# EasyEDA Pro project Sprig-C3 V1.0.1.epro, schematic ESP32-C6 LORA

## Sheets
1 P1: Board Name: Board1; Create Date: 2025-07-06; Page Name: P1; Project Name: ESP32-C3 module_2024-02-14_10-07-03; Schematic Name: ESP32-C6 LORA; Update Date: 2025-07-08; Company: EasyEDA.com; Page Size: A4; Version: V1.0
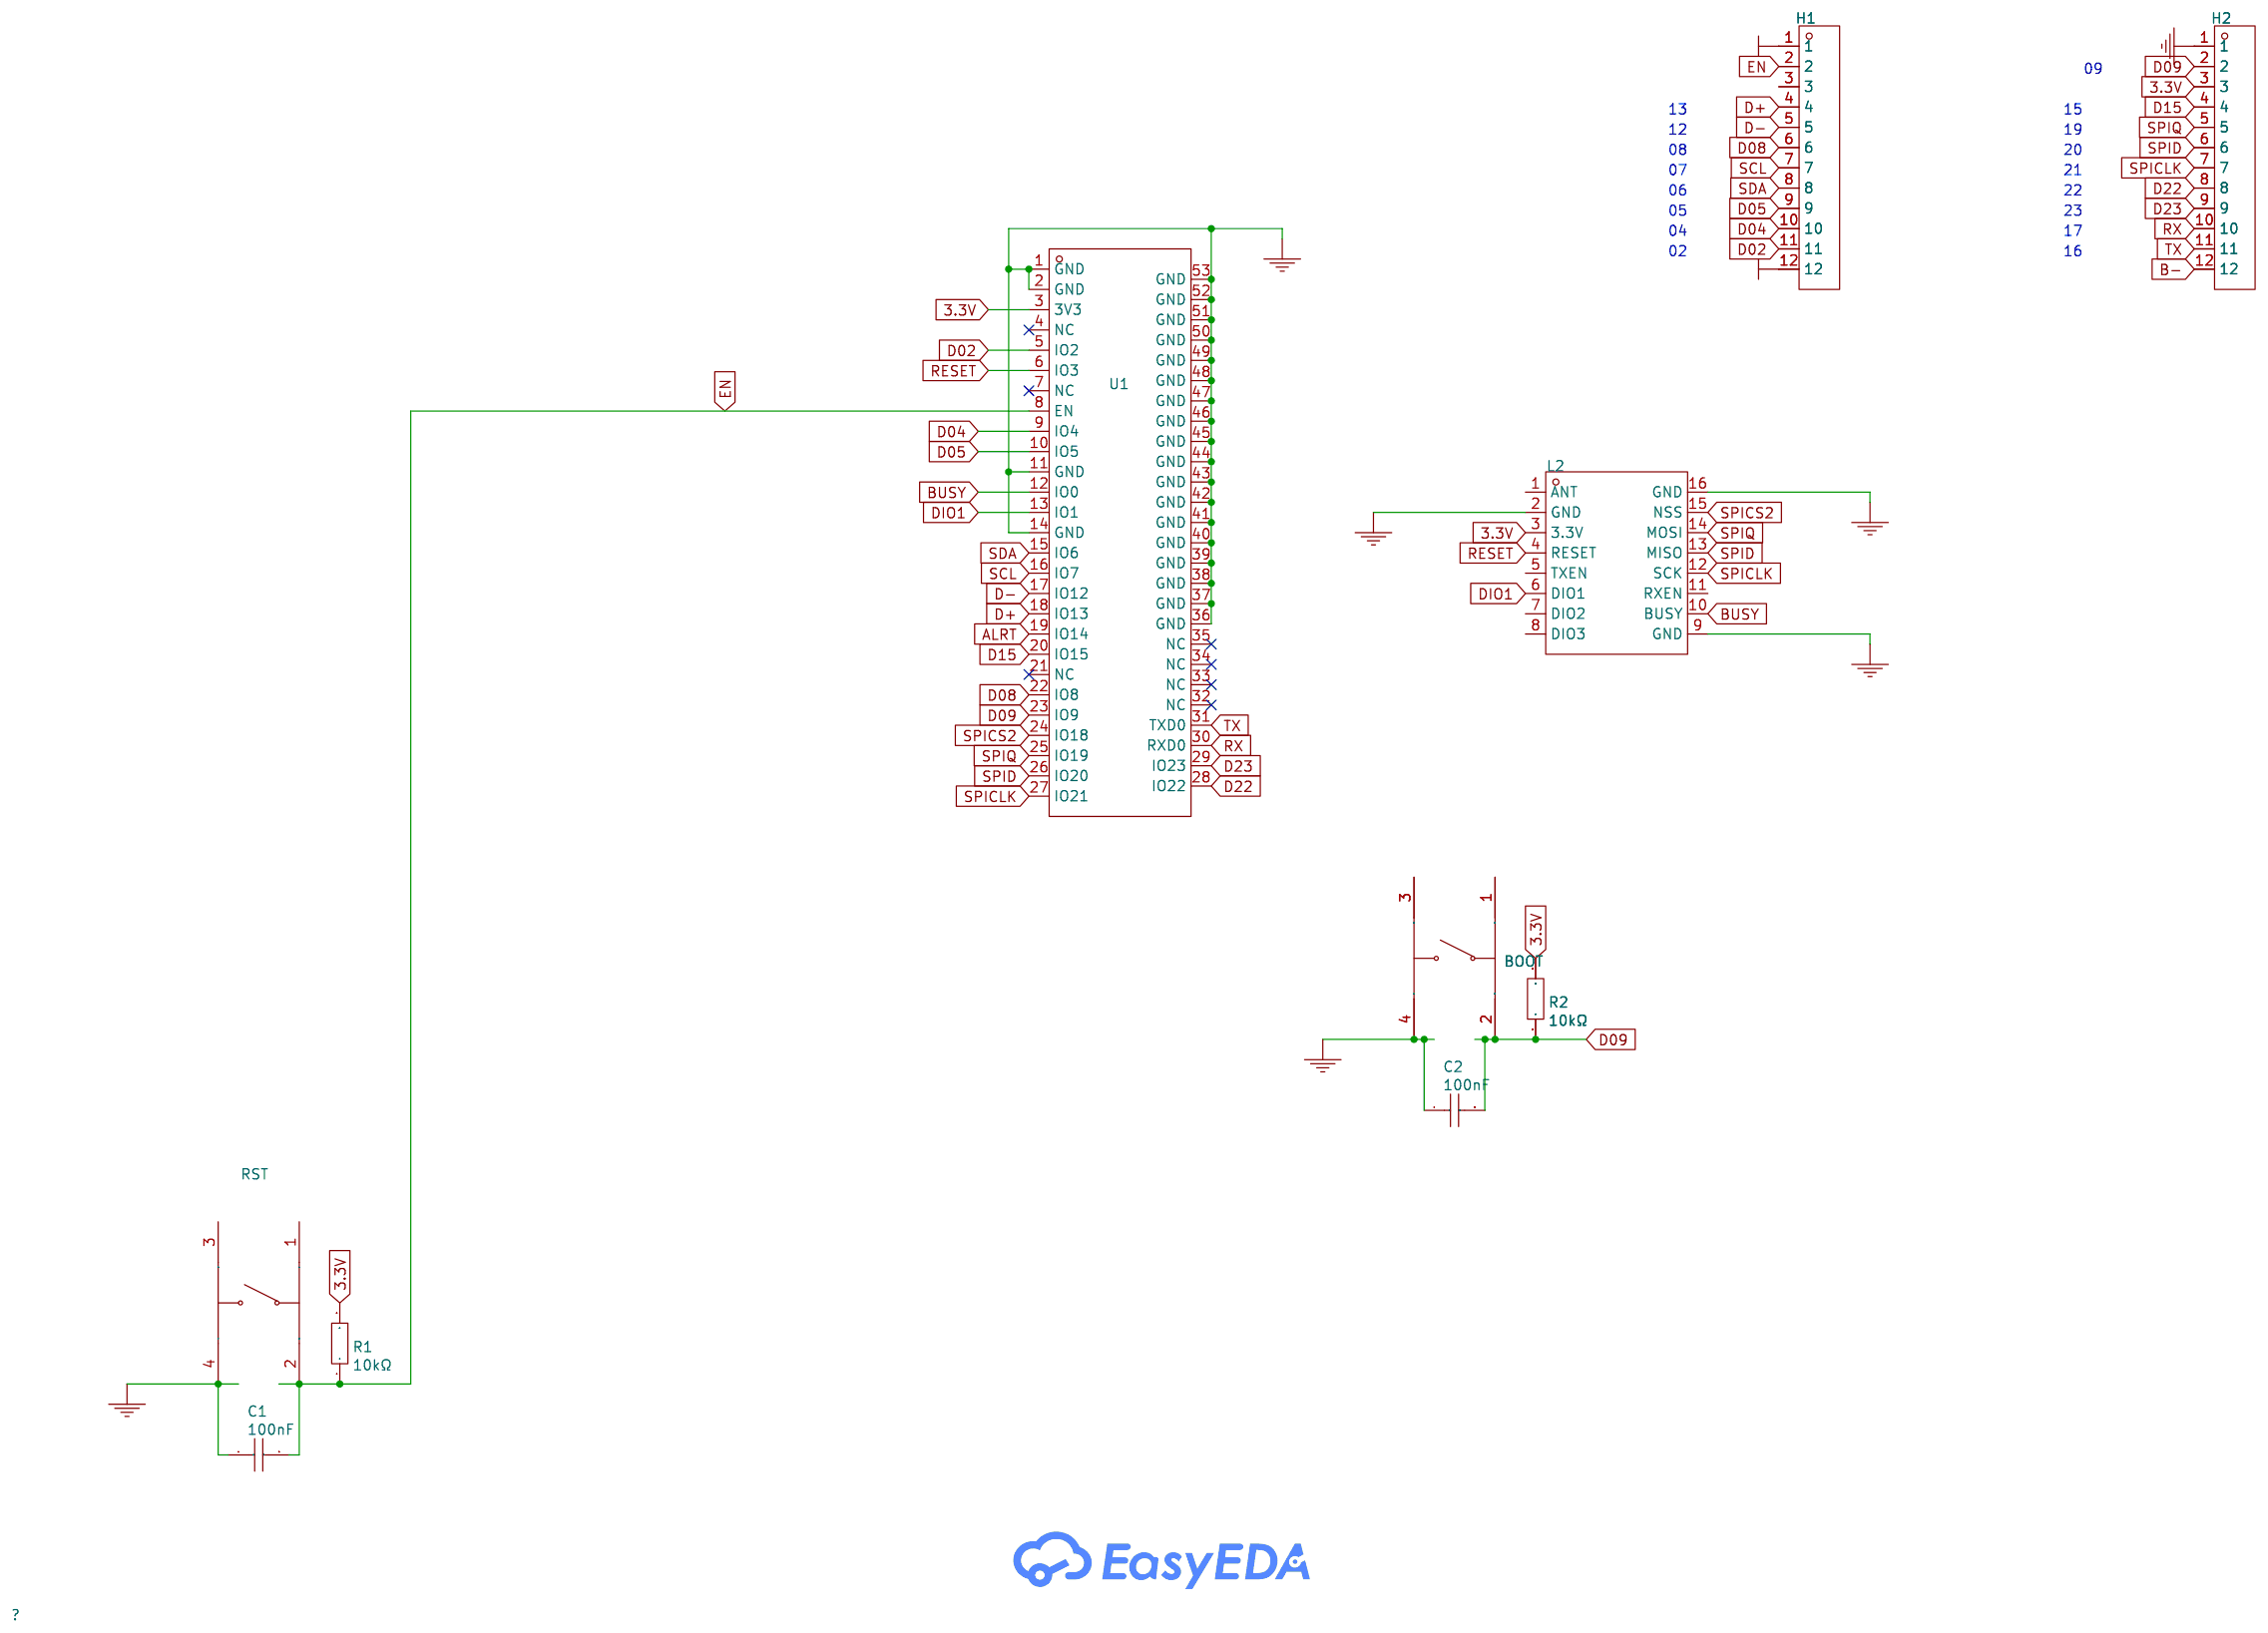
[diagram p0: P1]
2 P2: Page Name: P2; Update Date: 2025-08-02
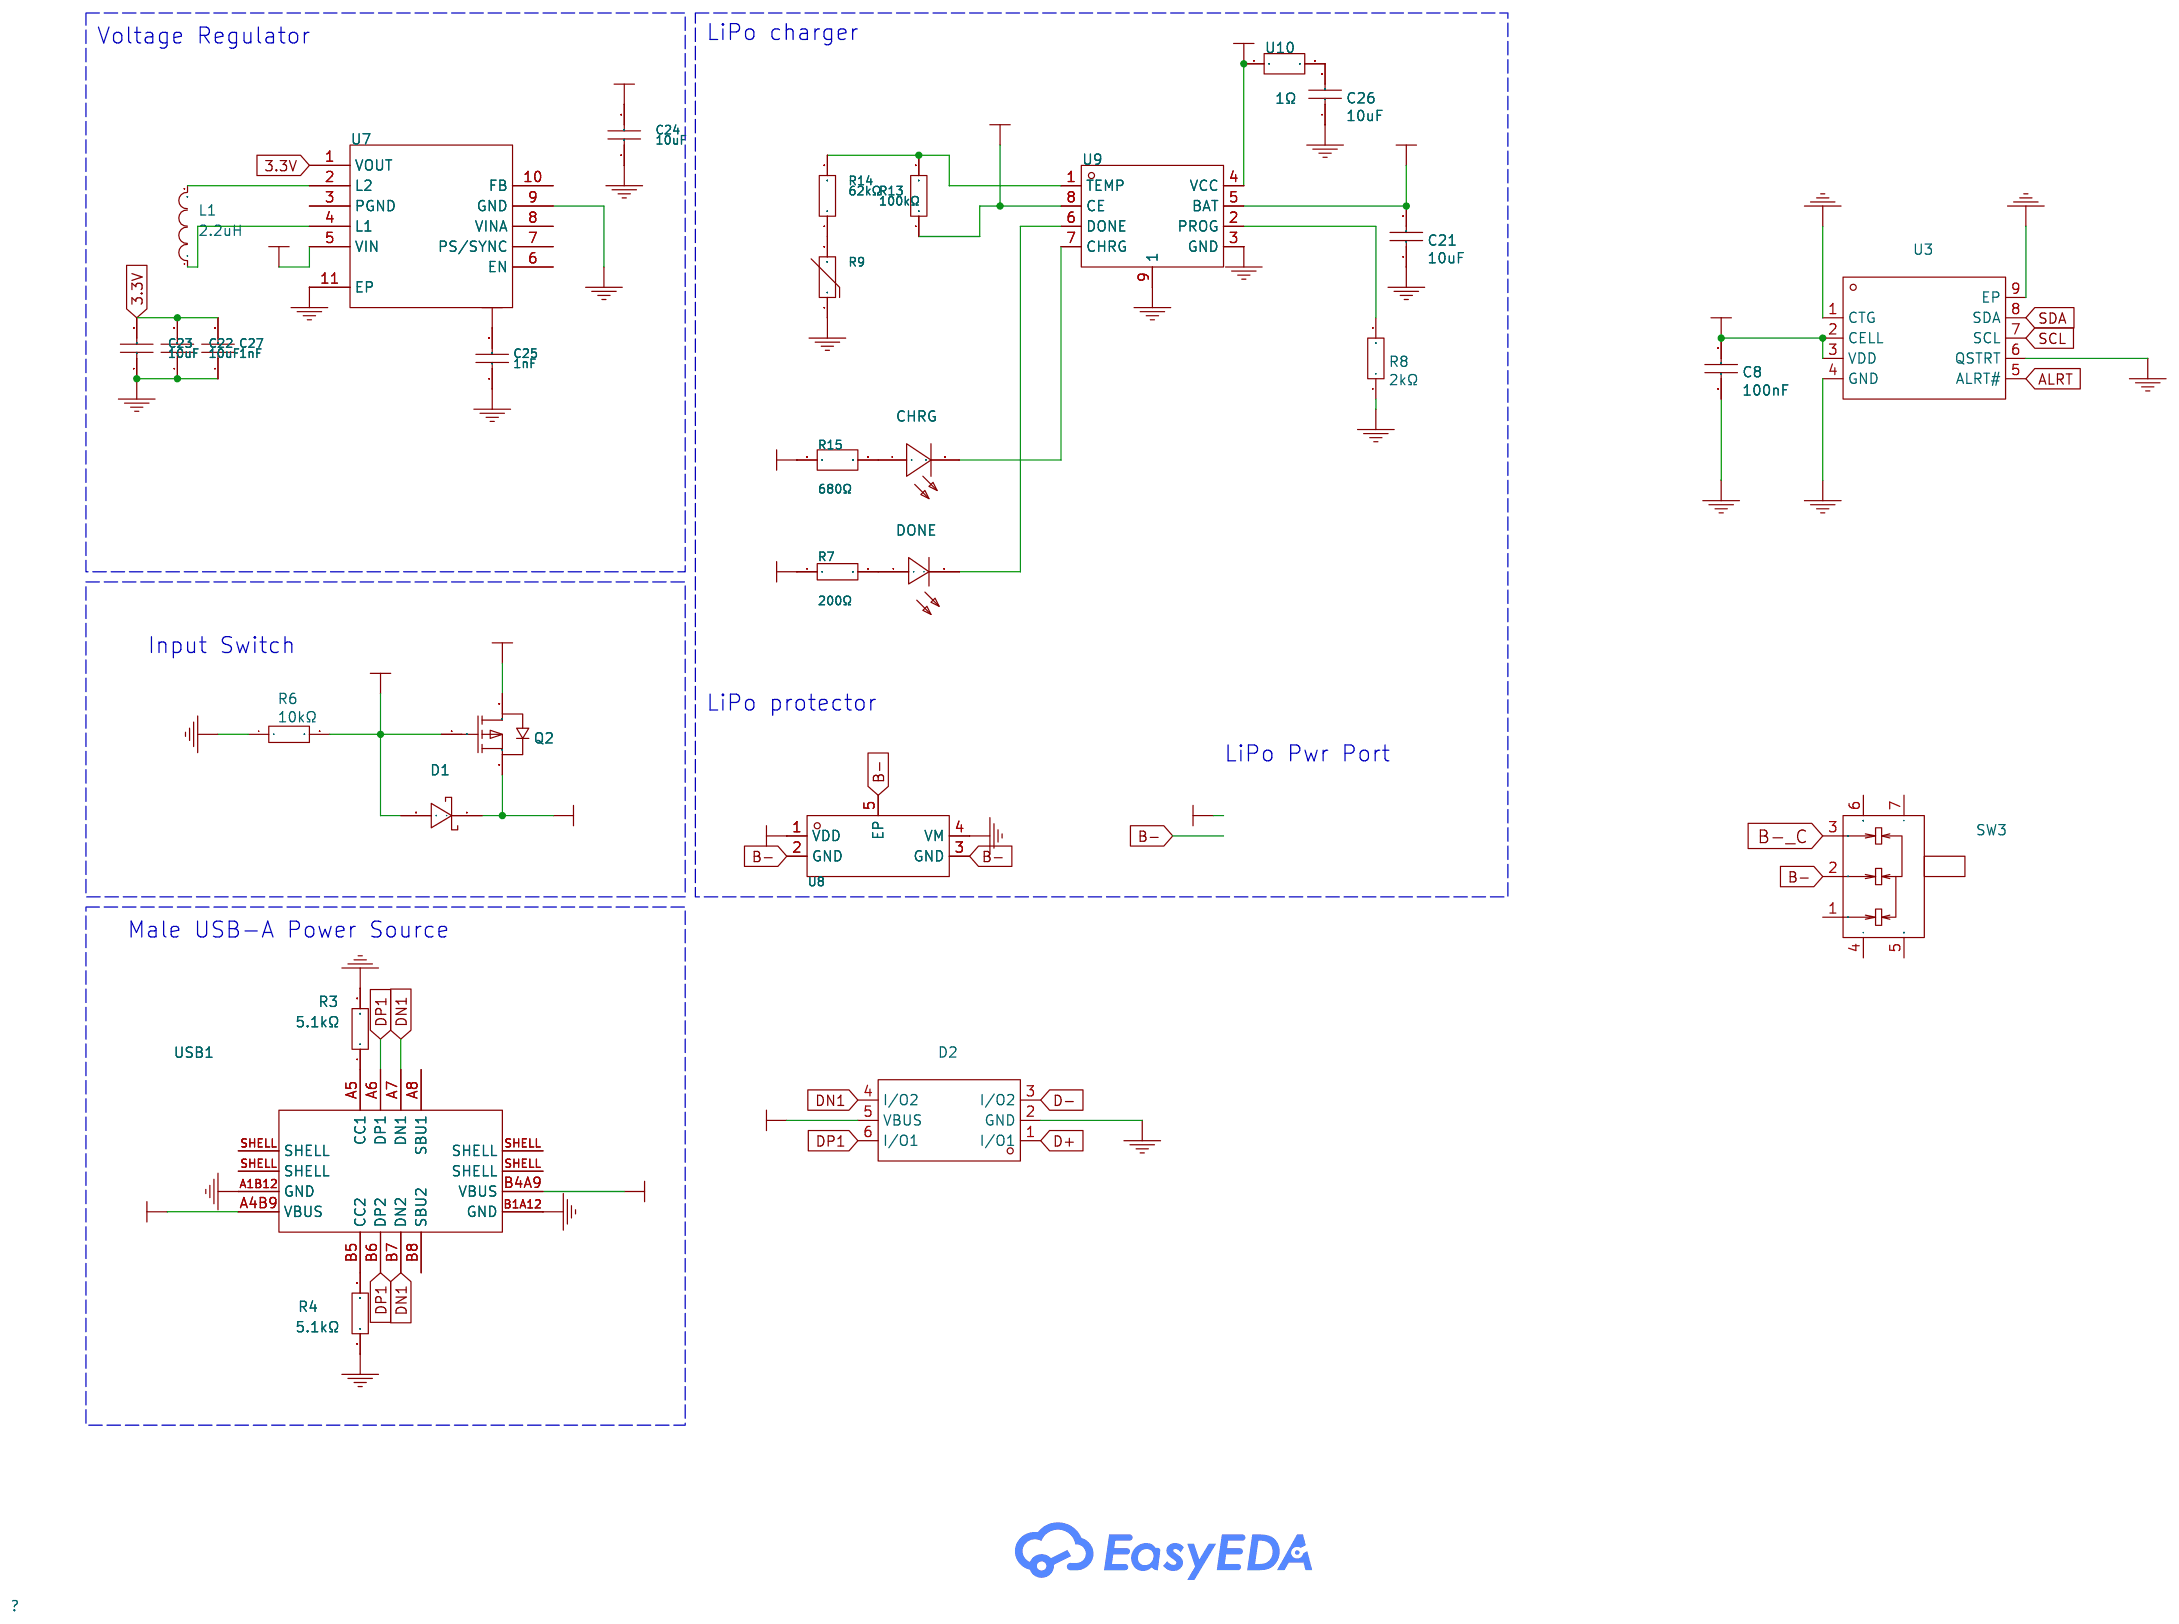
[diagram p1: P2]

## Parts
sheet P1
BOOT  TSA016A2518C  [SW-SMD_4P-L4.2-W3.3-P2.15-LS4.6]
C1  100nF  [C0402]
C2  100nF  [C0402]
H1  HC-PZ254-11.5L-1x12PZ  [HDR-TH_12P-P2.54-V-M]
H2  HC-PZ254-11.5L-1x12PZ  [HDR-TH_12P-P2.54-V-M]
L2  Ra-01SC-I  [COMM-SMD_16P-L17.0-W16.0-P2.00-1]
R1  10kΩ  [R0402]
R2  10kΩ  [R0402]
RST  TSA016A2518C  [SW-SMD_4P-L4.2-W3.3-P2.15-LS4.6]
U1  ESP32-C6-MINI-1-N4  [WIFIM-SMD_61P-L16.6-W13.2-P0.80-ESP32-C6-MINI-1-N4]
sheet P2
C8  100nF  [C0402]
C21  10uF  [C0402]
C22  10uF  [C0402]
C23  10uF  [C0402]
C24  10uF  [C0402]
C25  1nF  [C0402]
C26  10uF  [C0402]
C27  1nF  [C0402]
CHRG  NCD0603O3  [LED0603-RD]
D1  B5819W SL  [SOD-123_L2.7-W1.6-LS3.7-RD-1]
D2  USBLC6-2P6  [SOT-666-6_L1.6-W1.2-P0.50-LS1.6-BL]
DONE  XL-1608UGC-04  [LED0603-RD_GREEN]
L1  2.2uH  [L1210]
Q2  AO3401A  [SOT-23_L2.9-W1.3-P1.90-LS2.4-BR]
R3  5.1kΩ  [R0402]
R4  5.1kΩ  [R0402]
R6  10kΩ  [R0402]
R7  200Ω  [R0402]
R8  2kΩ  [R0402]
R9  FNTC0805X104F4250FB  [R0805]
R13  100kΩ  [R0402]
R14  62kΩ  [R0402]
R15  680Ω  [R0402]
SW3  MK-12C03-G015  [SW-SMD_MK-12C03-G015]
U3  MAX17048G+T10  [DFN-8_L2.0-W2.0-P0.50-BL-EP]
U7  TPS63031DSKR  [SON-10_L2.5-W2.5-P0.50-TL-EP]
U8  AP6683  [DFN-4_L1.0-W1.0-P0.65-BL-EP]
U9  LGS4056H  [DFN-8_L2.0-W2.0-P0.50-TL-EP1.6]
U10  1Ω  [R0402]
USB1  U262-161N-4BVC11  [USB-3.1-SMD_U262-161N-4BVC11]

## Library data of the parts
BOOT RST = TSA016A2518C: Actuator Style:Oval button Operating Force:180gf Mounting Style:Brick nogging Switch Length:4.2mm Switch Width:3.35mm Switch Height:2.5mm Contact Current:50mA Voltage Rating (AC):- Voltage Rating (DC):12V Actuator/Cap Color:White Mechanical Life:-; LCSC Part Name: 4.2*3.35*2.5mm 立贴 轻触开关; Supplier Part: C2888430; Manufacturer: BZCN(博众电气); Supplier Footprint: SMD; JLCPCB Part Class: Extended Part; Datasheet: https://atta.szlcsc.com/upload/public/pdf/source/20210906/0198B859780D4FA617E4EB862D7350E5.pdf; Supplier: LCSC; Actuator Style: Oval button; Operating Force: 180gf; Mounting Style: Brick nogging; Switch Length: 4.2mm; Switch Width: 3.35mm; Switch Height: 2.5mm; Contact Current: 50mA; Voltage Rating (DC): 12V; Actuator/Cap Color: White
C1 C2 C8 = 0402B104K160NT: Capacitance:100nF Tolerance:±10% Tolerance:±10% Voltage Rated: Temperature Coefficient:; LCSC Part Name: 100nF ±10% 16V; Supplier Part: C41851; Manufacturer: FH(风华); Supplier Footprint: 0402; JLCPCB Part Class: Extended Part; Datasheet: https://atta.szlcsc.com/upload/public/pdf/source/20200305/C486355_26A10D38EF8C2A5C37091D0039909270.pdf; Supplier: LCSC; Tolerance: ±10%
H1 H2 = HC-PZ254-11.5L-1x12PZ: Pin Structure:1x12P Pitch:2.54mm Row Spacing:- Circluar Pins/Square Pins:Policy Mounting Type:Straight Number of Rows:Single Row Number of Pins:12P Current Rating:3A Voltage Rating (Max):- Length of Mating Pin:6mm Insulation Height:2.5mm Length of End Con; LCSC Part Name: 1x12P 间距:2.54mm 方针 直插; Supplier Part: C27985195; Manufacturer: HC(虹成电子); Supplier Footprint: 插件,P=2.54mm; JLCPCB Part Class: Extended Part; Datasheet: https://atta.szlcsc.com/upload/public/pdf/source/20250106/83146CB85A93C3B169B932E1AD2F2636.pdf; Supplier: LCSC; Pin Structure: 1x12P; Pitch: 2.54mm; Circluar Pins/Square Pins: Policy; Mounting Type: Straight; Number of Rows: Single Row; Number of Pins: 12P; Current Rating: 3A; Length of Mating Pin: 6mm; Insulation Height: 2.5mm; Length of End Connection Pin: 3mm; Contact Material: Brass; Contact Plating: Gold; Operating Temperature: -40℃~+105℃; Color: Black
L2 = Ra-01SC-I: Supplier Part: C2830750; Manufacturer: Ai-Thinker(安信可); Supplier Footprint: SMD,16x17mm; JLCPCB Part Class: Extended Part; Datasheet: https://atta.szlcsc.com/upload/public/pdf/source/20210507/C2830750_6D17E5EC4E885B0E5B09D27E386E2B2A.pdf; Supplier: LCSC
R1 R2 = RMS04FT1002: Type:Thick Film Resistors Resistance: Tolerance:±1% Tolerance:±1% Power(Watts): Overload Voltage (Max): Temperature Coefficient:±100ppm/℃ Temperature Coefficient:±100ppm/℃ Operating Temperature Range:-55℃~+155℃ Operating Temperature Range:-55℃~+155℃; LCSC Part Name: 厚膜电阻 10kΩ ±1% 62.5mW; Supplier Part: C208775; Manufacturer: 大毅科技; Supplier Footprint: 0402; JLCPCB Part Class: Extended Part; Datasheet: https://atta.szlcsc.com/upload/public/pdf/source/20190313/C209057_DB28D2F9A2E1A0AF6BB7AAA99A28D7CC.pdf; Supplier: LCSC; Type: Thick Film Resistors; Tolerance: ±1%; Temperature Coefficient: ±100ppm/℃; Operating Temperature Range: -55℃~+155℃; link: https://lcsc.com/eda_search?q=C208775&amp;%26type=1&amp;ref=editor
U1 = ESP32-C6-MINI-1-N4: Supplier Part: C5736265; Manufacturer: ESPRESSIF(乐鑫); Supplier Footprint: SMD-53P; JLCPCB Part Class: Extended Part; Datasheet: https://atta.szlcsc.com/upload/public/pdf/source/20241030/4F3760582B039FB0FD0E1D65FBCFB6F4.pdf; Supplier: LCSC
C21-C24 C26 = CL05A106MQ5NUNC: Capacitance: Tolerance:±20% Tolerance:±20% Voltage Rated: Temperature Coefficient:; LCSC Part Name: 10uF ±20% 6.3V; Supplier Part: C15525; Manufacturer: SAMSUNG(三星); Supplier Footprint: 0402; JLCPCB Part Class: Basic Part; Datasheet: https://atta.szlcsc.com/upload/public/pdf/source/20220823/2B02EE04F8F211D38A52DCB16EB6BEBA.pdf; Supplier: LCSC; Tolerance: ±20%
C25 C27 = CC0402KRX7R9BB102: Capacitance: Tolerance:±10% Tolerance:±10% Voltage Rated: Temperature Coefficient:; LCSC Part Name: 1nF ±10% 50V; Supplier Part: C106205; Manufacturer: YAGEO(国巨); Supplier Footprint: 0402; JLCPCB Part Class: Extended Part; Datasheet: https://atta.szlcsc.com/upload/public/pdf/source/20181008/C309510_22F155564471FAF6A489F7D68F34234E.pdf; Supplier: LCSC; Tolerance: ±10%
CHRG = NCD0603O3: Emitted Color:Orange Forward Voltage (VF):1.6V~2.4V Forward Voltage (VF):1.6V~2.4V Power Dissipation:65mW Forward Current:25mA Dominant Wavelength:601nm~610nm Dominant Wavelength:601nm~610nm Peak Wavelength:610nm Lens Color:无色透明透镜 Luminous Intensity:24mcd; Supplier Part: C7429913; Manufacturer: 国星光电; Supplier Footprint: 0603; JLCPCB Part Class: Extended Part; Datasheet: https://atta.szlcsc.com/upload/public/pdf/source/20230620/6A7C990163D71C49E86FABD0D2A51869.pdf; Supplier: LCSC; Emitted Color: Orange; Forward Voltage (VF): 1.6V~2.4V; Power Dissipation: 65mW; Forward Current: 25mA; Dominant Wavelength: 601nm~610nm; Peak Wavelength: 610nm; Lens Color: 无色透明透镜; Luminous Intensity: 24mcd~80mcd; Viewing Angle: 140°; Operating Temperature: -30℃~+85℃; Mounting Sytle: Positive post
D1 = B5819W SL: Forward Voltage (Vf@If):600mV@1A Reverse Voltage (Vr):40V Average Rectified Current (Io):1A; LCSC Part Name: 电压:40V 电流:1A; Supplier Part: C8598; Manufacturer: CJ(江苏长电/长晶); Supplier Footprint: SOD-123; JLCPCB Part Class: Basic Part; Datasheet: https://atta.szlcsc.com/upload/public/pdf/source/20171228/C164911_15144413243851213914.pdf; Supplier: LCSC; Forward Voltage (Vf@If): 600mV@1A; Reverse Voltage (Vr): 40V; Average Rectified Current (Io): 1A
D2 = USBLC6-2P6: Type:ESD; LCSC Part Name: MSL=3; Supplier Part: C2827693; Manufacturer: TECH PUBLIC(台舟); Supplier Footprint: SOT-666-6; JLCPCB Part Class: Extended Part; Datasheet: https://atta.szlcsc.com/upload/public/pdf/source/20210810/36353A9194EA9F4E33F8AE18BE051AEA.pdf; Supplier: LCSC; Type: ESD
DONE = XL-1608UGC-04: Lamp Holder Type:- Emitted Color:Emerald Forward Voltage (VF):- Forward Voltage (VF):- Power Dissipation:80mW Forward Current:25mA Dominant Wavelength:516nm~525nm Dominant Wavelength:516nm~525nm Peak Wavelength:534nm Diode Configuration:独立二极管 Lens Color:无; Supplier Part: C965804; Manufacturer: XINGLIGHT(成兴光); Supplier Footprint: 0603; JLCPCB Part Class: Extended Part; Datasheet: https://atta.szlcsc.com/upload/public/pdf/source/20221102/520D6E465E5CFD1609C8A4DBC80D4018.pdf; Supplier: LCSC; Emitted Color: Emerald; Power Dissipation: 80mW; Forward Current: 25mA; Dominant Wavelength: 516nm~525nm; Peak Wavelength: 534nm; Diode Configuration: 独立二极管; Lens Color: 无色透明透镜; Viewing Angle: 120°; Mounting Sytle: Positive post; Operating Temperature: -30℃~+85℃
L1 = TFM322512ALMA2R2MTAA: Inductance: Tolerance:±20% Tolerance:±20% Rated Current: Saturation Current (Isat): DC Resistance (DCR):77mΩ Q @ Freq:- Ratings:AEC-Q200 Type:Thin film inductor; LCSC Part Name: 2.2uH ±20% 3.3A; Supplier Part: C5331030; Manufacturer: TDK; Supplier Footprint: 1210; JLCPCB Part Class: Extended Part; Datasheet: https://atta.szlcsc.com/upload/public/pdf/source/20221215/FB2623947F3CE304195B667604CDDDC1.pdf; Supplier: LCSC; Tolerance: ±20%; DC Resistance (DCR): 77mΩ; Ratings: AEC-Q200; Type: Thin film inductor
Q2 = AO3401A_C15127: Type: Drain Source Voltage (Vdss): Continuous Drain Current (Id): Power Dissipation (Pd): Drain Source On Resistance (RDS(on)@Vgs,Id):44mΩ@10V,4.3A Gate Threshold Voltage (Vgs(th)@Id):1.3V@250uA Total Gate Charge (Qg@Vgs):12.2nC@4.5V Input Capacitance (Ci; LCSC Part Name: P沟道 耐压:30V 电流:4A; Supplier Part: C15127; Manufacturer: AOS; Supplier Footprint: SOT-23; JLCPCB Part Class: Basic Part; Datasheet: https://atta.szlcsc.com/upload/public/pdf/source/20160507/1462613609053.pdf; Supplier: LCSC; Drain Source On Resistance (RDS(on)@Vgs,Id): 44mΩ@10V,4.3A; Gate Threshold Voltage (Vgs(th)@Id): 1.3V@250uA; Total Gate Charge (Qg@Vgs): 12.2nC@4.5V; Input Capacitance (Ciss@Vds): 1.2nF@15V; Operating Temperature: -55℃~+150℃@(Tj); image: //image.lceda.cn/szlcsc/C15127.jpg
R3 R4 = 0402WGJ0512TCE: Type:Thick Film Resistors Resistance:5.1kΩ Tolerance:±5% Tolerance:±5% Power(Watts): Overload Voltage (Max): Temperature Coefficient:±100ppm/℃ Temperature Coefficient:±100ppm/℃ Operating Temperature Range:-55℃~+155℃ Operating Temperature Range:-55℃~+155℃; LCSC Part Name: 5.1kΩ ±5% 62.5mW 厚膜电阻; Supplier Part: C25941; Manufacturer: UNI-ROYAL(厚声); Supplier Footprint: 0402; JLCPCB Part Class: Extended Part; Datasheet: https://atta.szlcsc.com/upload/public/pdf/source/20200306/C422600_1E6D84923E4A46A82E41ADD87F860B5C.pdf; Supplier: LCSC; Type: Thick Film Resistors; Tolerance: ±5%; Temperature Coefficient: ±100ppm/℃; Operating Temperature Range: -55℃~+155℃; Resistance: 5.1K
R6 = RMS04FT1002: Type:Thick Film Resistors Resistance: Tolerance:±1% Tolerance:±1% Power(Watts): Overload Voltage (Max): Temperature Coefficient:±100ppm/℃ Temperature Coefficient:±100ppm/℃ Operating Temperature Range:-55℃~+155℃ Operating Temperature Range:-55℃~+155℃; LCSC Part Name: 厚膜电阻 10kΩ ±1% 62.5mW; Supplier Part: C208775; Manufacturer: 大毅科技; Supplier Footprint: 0402; JLCPCB Part Class: Extended Part; Datasheet: https://atta.szlcsc.com/upload/public/pdf/source/20190313/C209057_DB28D2F9A2E1A0AF6BB7AAA99A28D7CC.pdf; Supplier: LCSC; Type: Thick Film Resistors; Tolerance: ±1%; Temperature Coefficient: ±100ppm/℃; Operating Temperature Range: -55℃~+155℃
R7 = 0402WGF2000TCE: Type:Thick Film Resistors Resistance: Tolerance:±1% Tolerance:±1% Power(Watts): Overload Voltage (Max): Temperature Coefficient:±100ppm/℃ Temperature Coefficient:±100ppm/℃ Operating Temperature Range:-55℃~+155℃ Operating Temperature Range:-55℃~+155℃; LCSC Part Name: 200Ω ±1% 62.5mW 厚膜电阻; Supplier Part: C25087; Manufacturer: UNI-ROYAL(厚声); Supplier Footprint: 0402; JLCPCB Part Class: Basic Part; Datasheet: https://atta.szlcsc.com/upload/public/pdf/source/20200306/C422600_1E6D84923E4A46A82E41ADD87F860B5C.pdf; Supplier: LCSC; Type: Thick Film Resistors; Tolerance: ±1%; Temperature Coefficient: ±100ppm/℃; Operating Temperature Range: -55℃~+155℃
R8 = 0402WGF2001TCE: Type:Thick Film Resistors Resistance:2kΩ Tolerance:±1% Tolerance:±1% Power(Watts): Overload Voltage (Max): Temperature Coefficient:±100ppm/℃ Temperature Coefficient:±100ppm/℃ Operating Temperature Range:-55℃~+155℃ Operating Temperature Range:-55℃~+155℃; LCSC Part Name: 2kΩ ±1% 62.5mW 厚膜电阻; Supplier Part: C4109; Manufacturer: UNI-ROYAL(厚声); Supplier Footprint: 0402; JLCPCB Part Class: Basic Part; Datasheet: https://atta.szlcsc.com/upload/public/pdf/source/20200306/C422600_1E6D84923E4A46A82E41ADD87F860B5C.pdf; Supplier: LCSC; Type: Thick Film Resistors; Tolerance: ±1%; Temperature Coefficient: ±100ppm/℃; Operating Temperature Range: -55℃~+155℃
R9 = FNTC0805X104F4250FB: Resistance @ 25℃: B Constant (25℃/50℃): Resistance Tolerance: Power: B Constant Tolerance: Operating Temperature:-40℃~+125℃ Operating Temperature:-40℃~+125℃; Supplier Part: C41417469; Manufacturer: cjiang(长江微电); Supplier Footprint: 0805; Datasheet: https://atta.szlcsc.com/upload/public/pdf/source/20240927/680ED90FE3621BD417EAE7BF117A336D.pdf; Supplier: LCSC; Operating Temperature: -40℃~+125℃
R13 = 0402WGF1003TCE: Type:Thick Film Resistors Resistance:100kΩ Tolerance:±1% Tolerance:±1% Power(Watts): Overload Voltage (Max): Temperature Coefficient:±100ppm/℃ Temperature Coefficient:±100ppm/℃ Operating Temperature Range:-55℃~+155℃ Operating Temperature Range:-55℃~+155℃; LCSC Part Name: 100kΩ ±1% 62.5mW 厚膜电阻; Supplier Part: C25741; Manufacturer: UNI-ROYAL(厚声); Supplier Footprint: 0402; JLCPCB Part Class: Basic Part; Datasheet: https://atta.szlcsc.com/upload/public/pdf/source/20200306/C422600_1E6D84923E4A46A82E41ADD87F860B5C.pdf; Supplier: LCSC; Type: Thick Film Resistors; Tolerance: ±1%; Temperature Coefficient: ±100ppm/℃; Operating Temperature Range: -55℃~+155℃
R14 = ERJ2RKF6202X: Type:Thick Film Resistors Resistance:62kΩ Tolerance:±1% Tolerance:±1% Power(Watts): Overload Voltage (Max):- Temperature Coefficient:±100ppm/℃ Temperature Coefficient:±100ppm/℃ Operating Temperature Range:-55℃~+155℃ Operating Temperature Range:-55℃~+155℃; LCSC Part Name: 62kΩ ±1% 100mW 厚膜电阻; Supplier Part: C77604; Manufacturer: PANASONIC(松下); Supplier Footprint: 0402; JLCPCB Part Class: Extended Part; Datasheet: https://atta.szlcsc.com/upload/public/pdf/source/20190222/C77604_215DF19229BE9E910CAA70C582100C6C.pdf; Supplier: LCSC; Type: Thick Film Resistors; Tolerance: ±1%; Temperature Coefficient: ±100ppm/℃; Operating Temperature Range: -55℃~+155℃
R15 = RC-02K681JT: Type:Thick Film Resistors Resistance: Tolerance:±5% Tolerance:±5% Power(Watts): Overload Voltage (Max): Temperature Coefficient:±100ppm/℃ Temperature Coefficient:±100ppm/℃ Operating Temperature Range:-55℃~+155℃ Operating Temperature Range:-55℃~+155℃; LCSC Part Name: 厚膜电阻 680Ω ±5% 62.5mW; Supplier Part: C453746; Manufacturer: FH(风华); Supplier Footprint: 0402; JLCPCB Part Class: Extended Part; Datasheet: https://atta.szlcsc.com/upload/public/pdf/source/20140616/1457707091974.pdf; Supplier: LCSC; Type: Thick Film Resistors; Tolerance: ±5%; Temperature Coefficient: ±100ppm/℃; Operating Temperature Range: -55℃~+155℃
SW3 = MK-12C03-G015: Circuit:SPDT Actuator Style:Rectangular columnar Pin Style:SMDSplicing Switch Length:6.65mm Switch Width:2.75mm Switch Height:4.25mm Mounting Style:卧贴 Actuator Color:White Current Rating (DC):1A Voltage Rating (DC):6V Mechanical Life:1万次 Operating Tempera; LCSC Part Name: 新七脚小拨动开关 G1.5mm; Supplier Part: C2890358; Manufacturer: G-Switch(品赞); Supplier Footprint: SMD; JLCPCB Part Class: Extended Part; Datasheet: https://atta.szlcsc.com/upload/public/pdf/source/20240612/7D979AF25627BA0CE326E7EBF8EC90FA.pdf; Supplier: LCSC; Circuit: SPDT; Actuator Style: Rectangular columnar; Pin Style: SMDSplicing; Switch Length: 6.65mm; Switch Width: 2.75mm; Switch Height: 4.25mm; Mounting Style: 卧贴; Actuator Color: White; Current Rating (DC): 1A; Voltage Rating (DC): 6V; Mechanical Life: 1万次; Operating Temperature: -20℃~+70℃
U3 = MAX17048G+T10: The Chip Type:电池监测芯片 Type of Battery:锂离子/Polymer Number of Cells:1 Number of Cells:1 Operating Temperature:-20℃~+70℃ Operating Temperature:-20℃~+70℃; Supplier Part: C2682616; Manufacturer: ADI(亚德诺)/MAXIM(美信); Supplier Footprint: DFN-8-EP(2x2); JLCPCB Part Class: Extended Part; Datasheet: https://atta.szlcsc.com/upload/public/pdf/source/20210106/C2682616_818568B5D3BA4B627110FCAA33E0BFB1.pdf; Supplier: LCSC; The Chip Type: 电池监测芯片; Type of Battery: 锂离子/Polymer; Number of Cells: 1; Operating Temperature: -20℃~+70℃; link: https://lcsc.com/eda_search?q=C2682616&amp;%26type=1&amp;ref=editor
U7 = TPS63031DSKR: Function:Boost type Output Type:- Voltage - Supply:1.8V~5.5V Voltage - Supply:1.8V~5.5V Output Voltage:3.3V Output Voltage:3.3V Output Current:900mA Frequency - Switching:2.4MHz Frequency - Switching:2.4MHz Operating Temperature:-40℃~+125℃@(TJ) Operating; Supplier Part: C15516; Manufacturer: TI(德州仪器); Supplier Footprint: SON-10-EP(2.5x2.5); JLCPCB Part Class: Extended Part; Datasheet: https://www.ti.com/cn/lit/gpn/tps63031; Supplier: LCSC; Function: Boost type; Voltage - Supply: 1.8V~5.5V; Output Voltage: 3.3V; Output Current: 900mA; Frequency - Switching: 2.4MHz; Operating Temperature: -40℃~+125℃@(TJ); Synchronous Rectifier: Yes; Number of Outputs: 1; Topology: Step-down-Boost; Switch tube (built-in/external): Built-in
U8 = AP6683: Supplier Part: C2849565; Manufacturer: ALLPOWER(铨力); Supplier Footprint: DFN-4-EP(1x1); JLCPCB Part Class: Extended Part; Datasheet: https://atta.szlcsc.com/upload/public/pdf/source/20210723/C2849565_EA604836CC73D2108C5387801D1EBC6A.pdf; Supplier: LCSC
U9 = LGS4056H: The Chip Type:线性充电芯片 Supply Voltage:4V~6V Supply Voltage:4V~6V Maximum Charge Current:1A Charging Saturation Voltage:4.2V Type of Battery:锂离子/Polymer Number of Cells:1 Number of Cells:1 Operating Temperature:-40℃~+125℃ Operating Temperature:-40℃~+125℃; LCSC Part Name: TP4056H(DFN); Supplier Part: C5124109; Manufacturer: Legend-Si(棱晶半导体); Supplier Footprint: DFN-8(2x2); JLCPCB Part Class: Extended Part; Datasheet: https://atta.szlcsc.com/upload/public/pdf/source/20230407/EF281A5928E4D64337F5505487E44644.pdf; Supplier: LCSC; The Chip Type: 线性充电芯片; Supply Voltage: 4V~6V; Maximum Charge Current: 1A; Charging Saturation Voltage: 4.2V; Type of Battery: 锂离子/Polymer; Number of Cells: 1; Operating Temperature: -40℃~+125℃
U10 = FRC0402F1R00TS: Type:Thick Film Resistors Resistance: Tolerance:±1% Tolerance:±1% Power(Watts): Overload Voltage (Max): Temperature Coefficient:±200ppm/℃ Temperature Coefficient:±200ppm/℃ Operating Temperature Range:-55℃~+155℃ Operating Temperature Range:-55℃~+155℃; LCSC Part Name: 1Ω ±1% 62.5mW 厚膜电阻; Supplier Part: C2909329; Manufacturer: FOJAN(富捷); Supplier Footprint: 0402; JLCPCB Part Class: Extended Part; Datasheet: https://atta.szlcsc.com/upload/public/pdf/source/20211221/925EC7D7225764EE0046F22065062C87.pdf; Supplier: LCSC; Type: Thick Film Resistors; Tolerance: ±1%; Temperature Coefficient: ±200ppm/℃; Operating Temperature Range: -55℃~+155℃
USB1 = U262-161N-4BVC11: Connector Type:Type-C Standard:USB 3.1 Gender:Female Number of Ports:1 Number of Contacts:16P Mounting Style:卧贴 Current Rating - Power (Max):3A Contact Material:Copper Alloy Contact Plating:Gold Operating Temperature Range:-40℃~+85℃ Operating Temperature; LCSC Part Name: Type-C 母 卧贴; Supplier Part: C319148; Manufacturer: XKB Connectivity(中国星坤); Supplier Footprint: SMD; JLCPCB Part Class: Extended Part; Datasheet: https://atta.szlcsc.com/upload/public/pdf/source/20211015/B478CBA0F1623DA36A6CC6918C49C838.pdf; Supplier: LCSC; Connector Type: Type-C; Standard: USB 3.1; Gender: Female; Number of Ports: 1; Number of Contacts: 16P; Mounting Style: 卧贴; Current Rating - Power (Max): 3A; Contact Material: Copper Alloy; Contact Plating: Gold; Operating Temperature Range: -40℃~+85℃; Soldering Temperature(Max): 260℃

## Nets
3.3V: C22.2 C23.2 C27.2 H2.3 L2.3(3.3V) R1.2 R2.2 U1.3(3V3) U7.1(VOUT)
GND: BOOT.4 C1.1 C2.1 C8.1 C21.1 C22.1 C23.1 C24.1 C25.1 C26.1 C27.1 D2.2(GND) H2.1 L2.2(GND) L2.9(GND) L2.16(GND) R3.2 R4.1 R6.1 R8.1 R9.1 RST.4 U1.1(GND) U1.2(GND) U1.11(GND) U1.14(GND) U1.36(GND) U1.37(GND) U1.38(GND) U1.39(GND) U1.40(GND) U1.41(GND) U1.42(GND) U1.43(GND) U1.44(GND) U1.45(GND) U1.46(GND) U1.47(GND) U1.48(GND) U1.49(GND) U1.50(GND) U1.51(GND) U1.52(GND) U1.53(GND) U3.1(CTG) U3.4(GND) U3.6(QSTRT) U3.9(EP) U7.9(GND) U7.11(EP) U8.4(VM) U9.3(GND) U9.9(1) USB1.A1B12(GND) USB1.B1A12(GND)
VBAT: C8.2 C21.2 H1.12 Q2.3(D) U3.2(CELL) U3.3(VDD) U8.1(VDD) U9.5(BAT)
VCC: D1.2(+) D2.5(VBUS) H1.1 Q2.1(G) R6.2 R7.1 R13.1 R15.1 U9.4(VCC) U9.8(CE) U10.1 USB1.A4B9(VBUS) USB1.B4A9(VBUS)
VIN: C24.2 C25.2 D1.1(-) Q2.2(S) U7.5(VIN)
ALRT: U1.19(IO14) U3.5(ALRT#)
B-: H2.12 SW3.2 U8.2(GND) U8.3(GND) U8.5(EP)
B-_C: SW3.3
BUSY: L2.10(BUSY) U1.12(IO0)
D02: H1.11 U1.5(IO2)
D04: H1.10 U1.9(IO4)
D05: H1.9 U1.10(IO5)
D08: H1.6 U1.22(IO8)
D09: BOOT.2 C2.2 H2.2 R2.1 U1.23(IO9)
D15: H2.4 U1.20(IO15)
D22: H2.8 U1.28(IO22)
D23: H2.9 U1.29(IO23)
D+: D2.1(I/O1) H1.4 U1.18(IO13)
D-: D2.3(I/O2) H1.5 U1.17(IO12)
DIO1: L2.6(DIO1) U1.13(IO1)
DN1: D2.4(I/O2) USB1.A7(DN1) USB1.B7(DN2)
DP1: D2.6(I/O1) USB1.A6(DP1) USB1.B6(DP2)
EN: C1.2 H1.2 R1.1 RST.2 U1.8(EN)
RESET: L2.4(RESET) U1.6(IO3)
RX: H2.10 U1.30(RXD0)
SCL: H1.7 U1.16(IO7) U3.7(SCL)
SDA: H1.8 U1.15(IO6) U3.8(SDA)
SPICLK: H2.7 L2.12(SCK) U1.27(IO21)
SPICS2: L2.15(NSS) U1.24(IO18)
SPID: H2.6 L2.13(MISO) U1.26(IO20)
SPIQ: H2.5 L2.14(MOSI) U1.25(IO19)
TX: H2.11 U1.31(TXD0)
$2N1502: R3.1 USB1.A5(CC1)
$2N1504: R4.2 USB1.B5(CC2)
$2N1699: L1.2 U7.2(L2)
$2N1703: L1.1 U7.4(L1)
$2N3354: C26.2 U10.2
$2N3355: R8.2 U9.2(PROG)
$2N3357: R13.2 R14.2 U9.1(TEMP)
$2N3358: R9.2 R14.1
$2N3361: CHRG.2(K) U9.7(CHRG)
$2N3363: DONE.1(+) R7.2
$2N3364: DONE.2(-) U9.6(DONE)
$2N3366: CHRG.1(A) R15.2

Not connected (* = marked no-connect by the designer): BOOT 1 3; H1 3; L2 1(ANT) 5(TXEN) 7(DIO2) 8(DIO3) 11(RXEN); RST 1 3; SW3 1 4 5 6 7; U1 4(NC)* 7(NC)* 21(NC)* 32(NC)* 33(NC)* 34(NC)* 35(NC)*; U7 3(PGND) 6(EN) 7(PS/SYNC) 8(VINA) 10(FB); USB1 A8(SBU1) B8(SBU2) SHELL

## Notes on the sheets
sheet 1
- 09
- 13
- 15
- 12
- 19
- 07
- 08
- 20
- 21
- 06
- 22
- 05
- 23
- 04
- 17
- 02
- 16
sheet 2
- Voltage Regulator
- LiPo charger
- Input Switch
- LiPo protector
- LiPo Pwr Port
- Male USB-A Power Source
